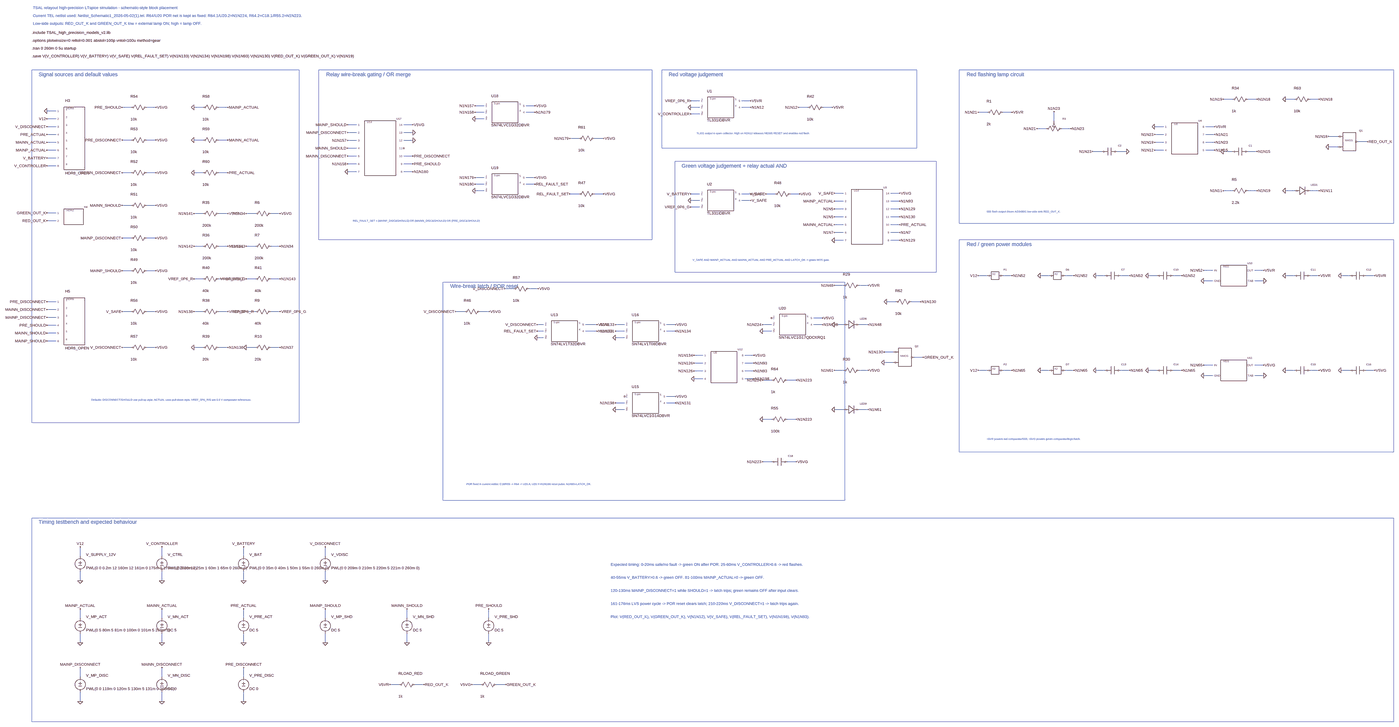
[diagram p0: schematic TSAL_relayout_high_precision.asc, whole sheet]
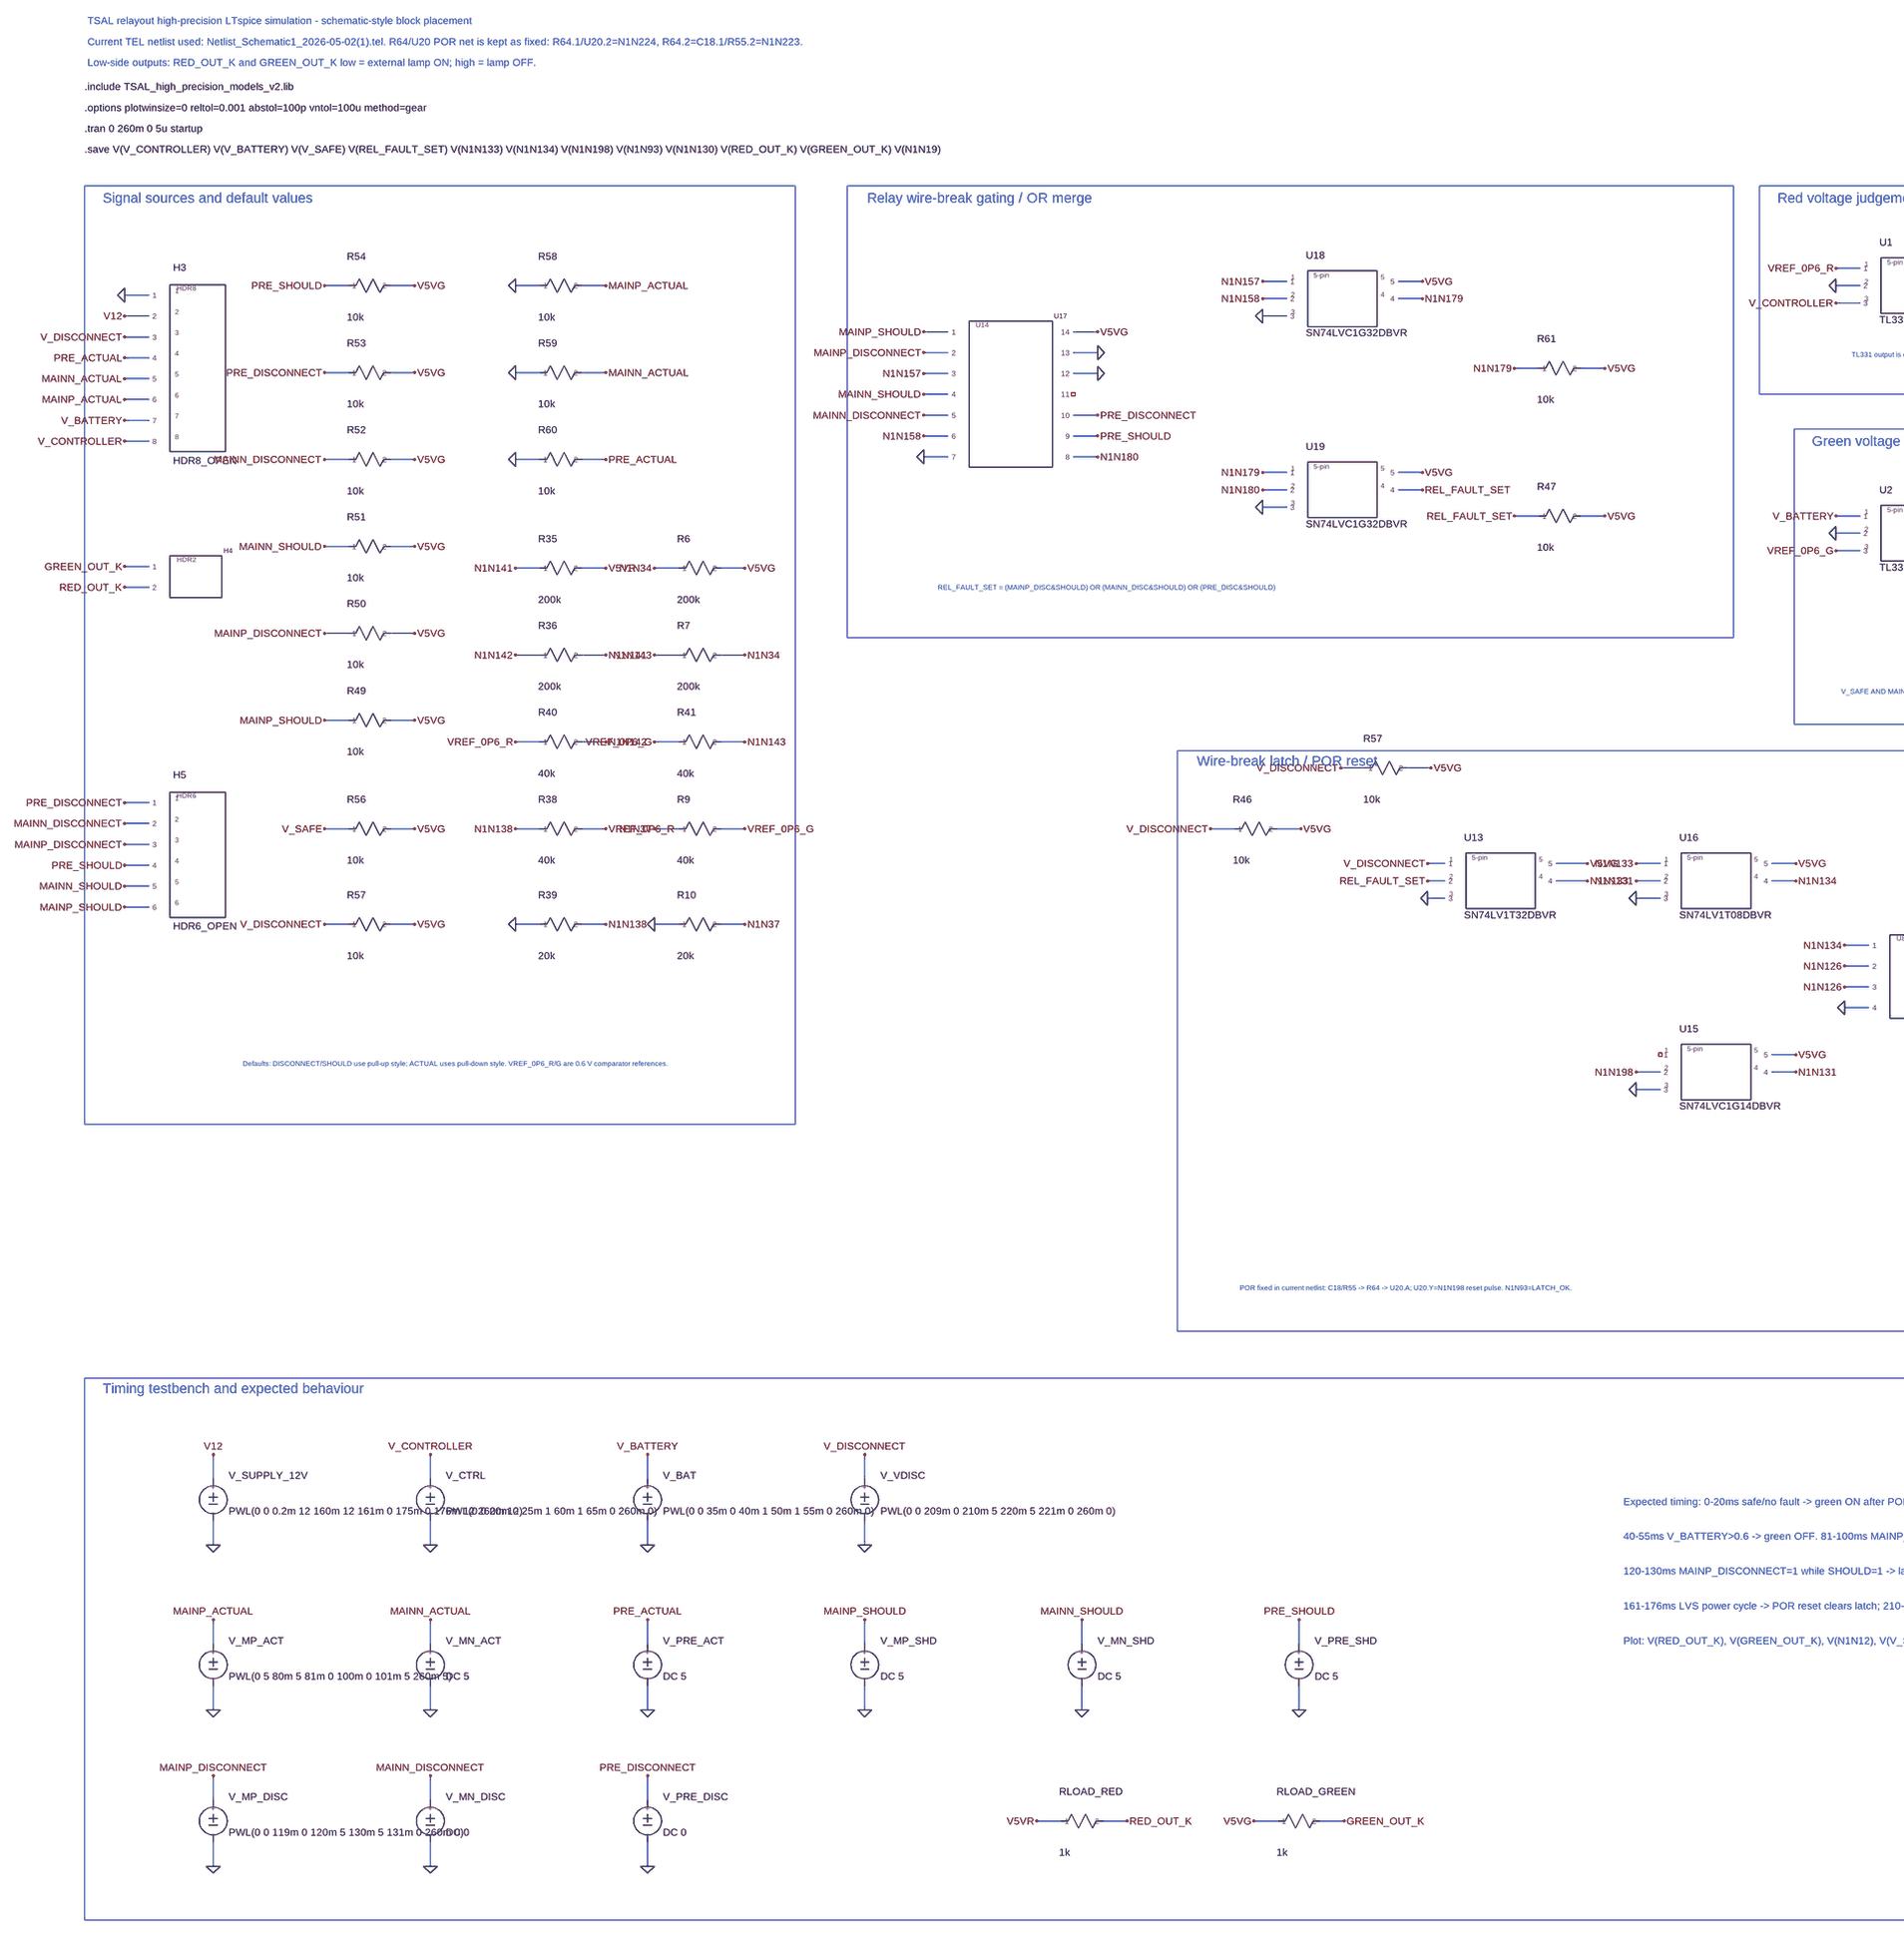
[diagram p1: schematic TSAL_relayout_high_precision.asc, part, row 1 of 1, column 1 of 2]
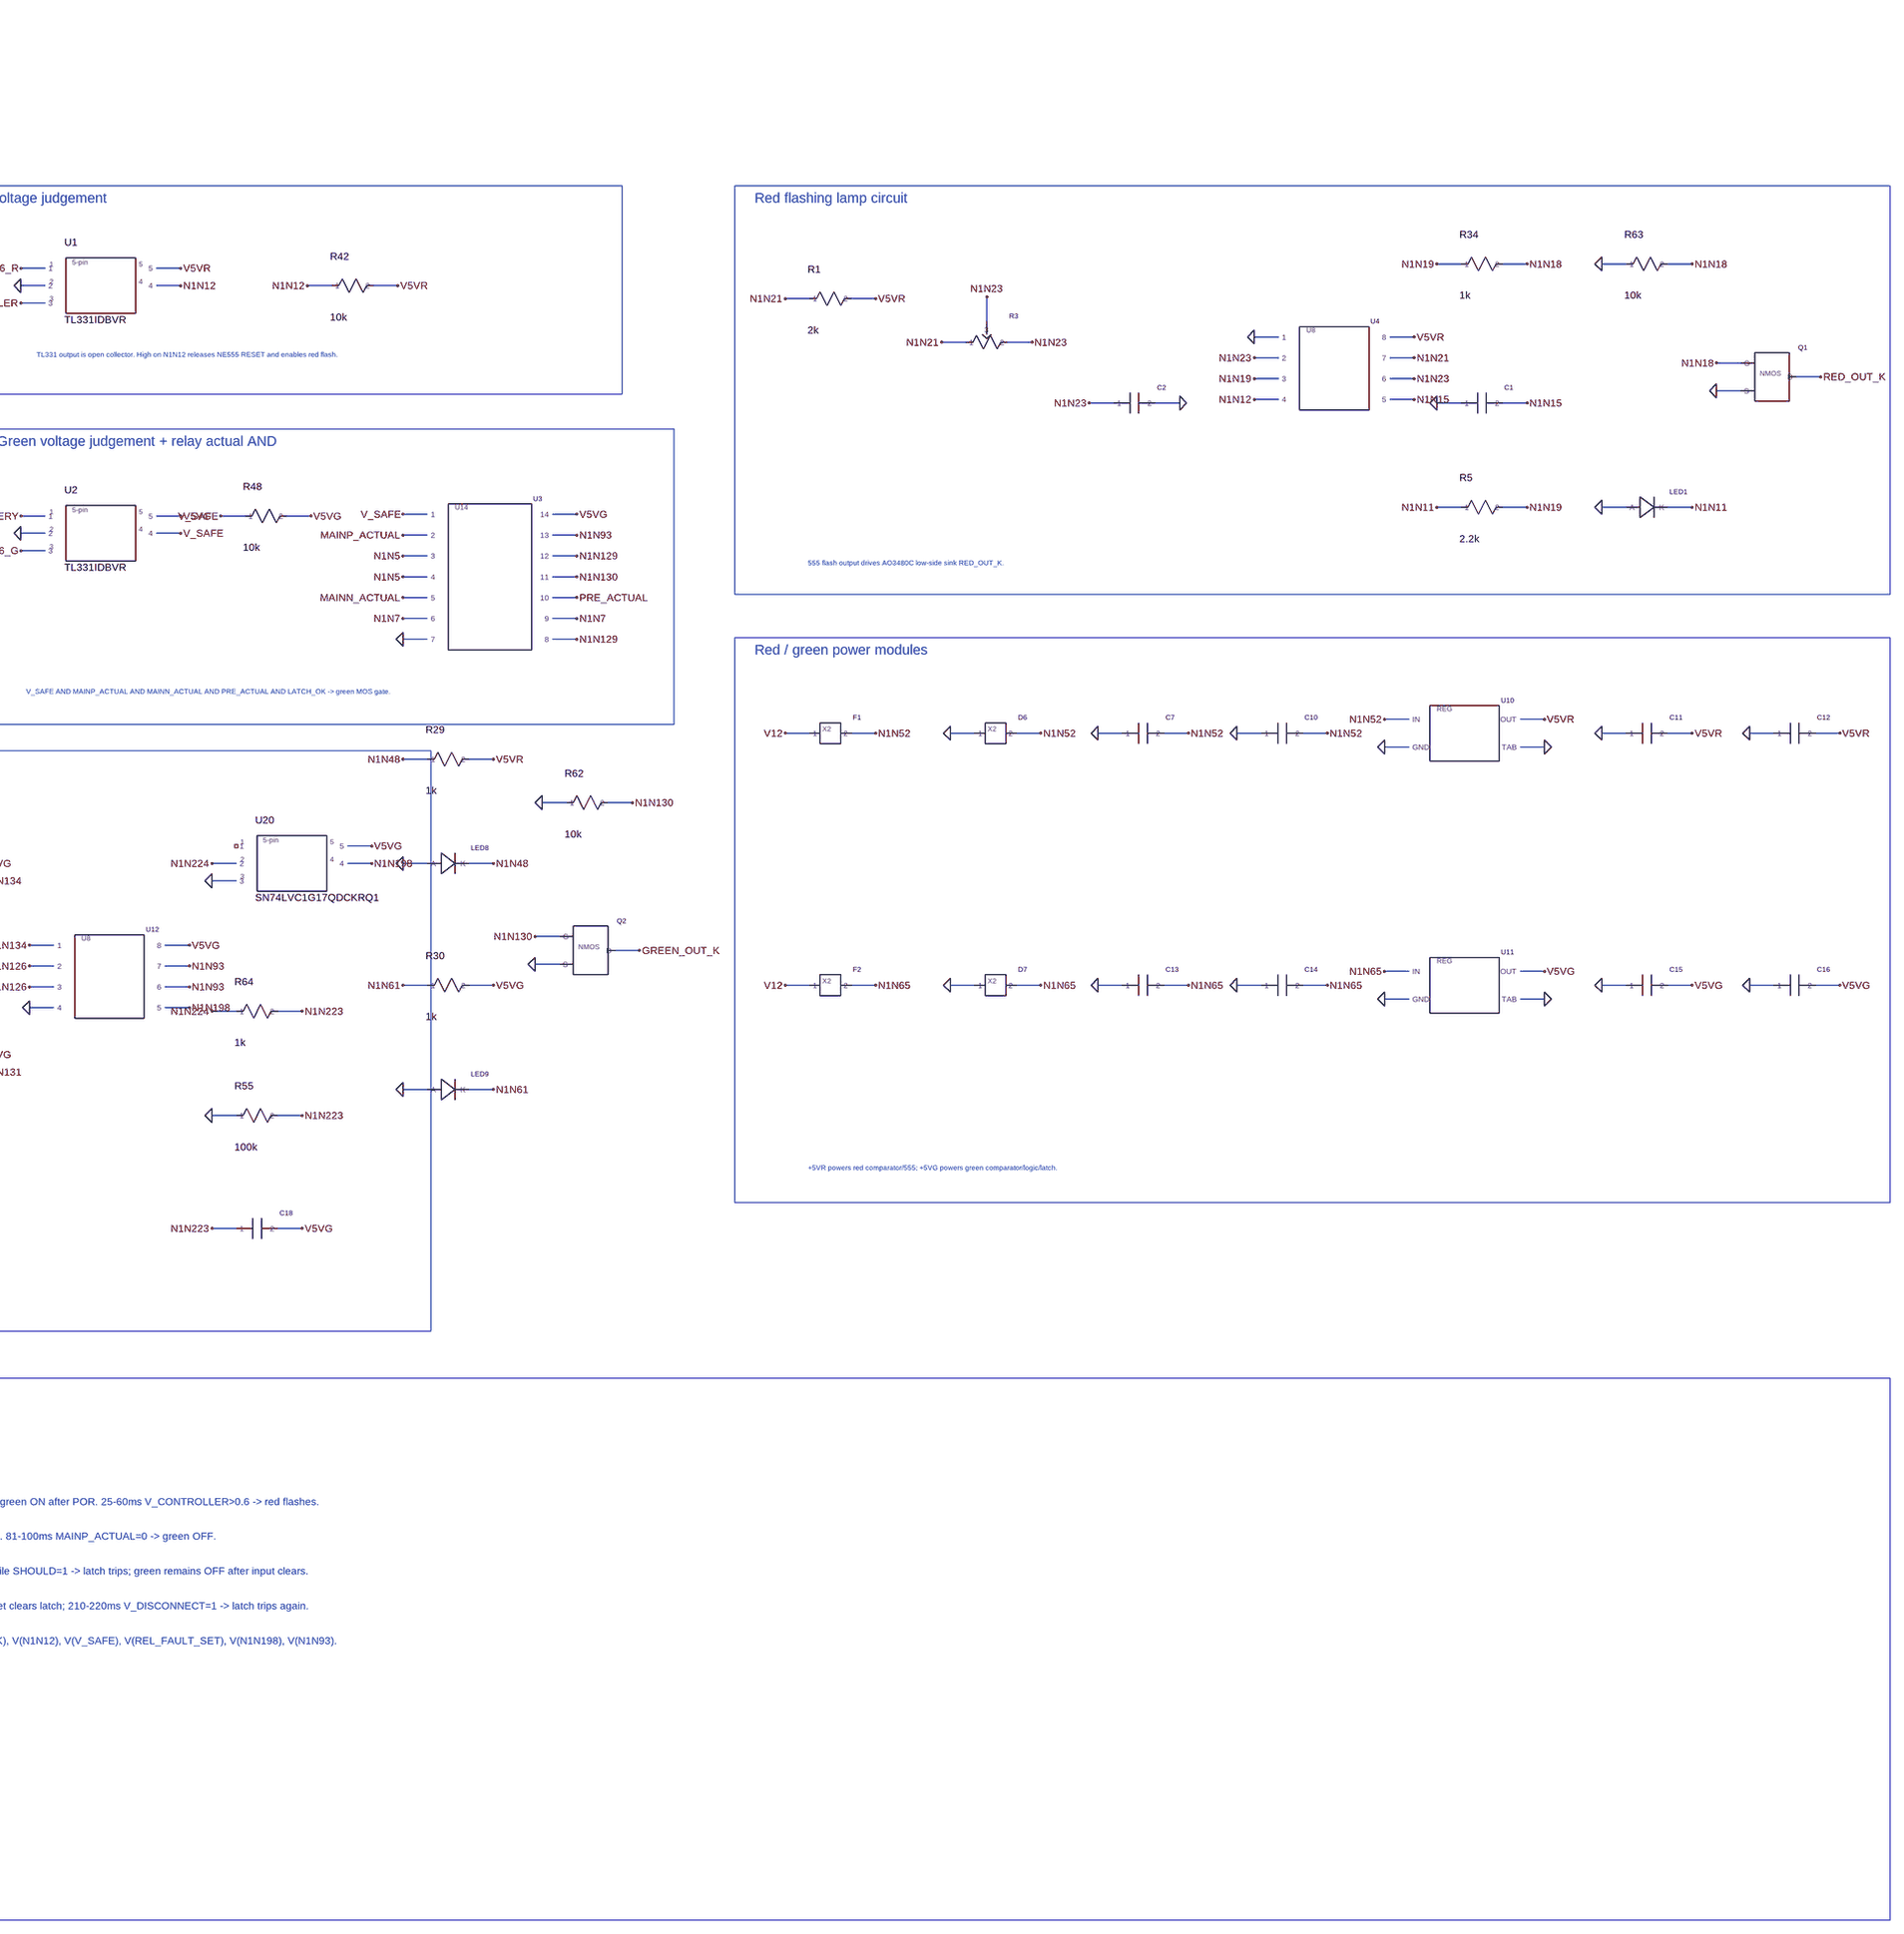
[diagram p2: schematic TSAL_relayout_high_precision.asc, part, row 1 of 1, column 2 of 2]
TSAL_relayout_high_precision.asc, the LTspice schematic file:
Version 4.1
SHEET 1 8600 5800
WIRE 7412 600 7356 600
WIRE 7564 600 7508 600
WIRE 7792 600 7736 600
WIRE 7944 600 7888 600
WIRE 4152 610 4096 610
WIRE 4464 610 4408 610
WIRE 2832 640 2776 640
WIRE 3144 640 3088 640
WIRE 672 650 616 650
WIRE 824 650 768 650
WIRE 1112 650 1056 650
WIRE 1264 650 1208 650
WIRE 4152 650 4096 650
WIRE 4464 650 4408 650
WIRE 4812 650 4756 650
WIRE 4964 650 4908 650
WIRE 212 672 156 672
WIRE 2832 680 2776 680
WIRE 3144 680 3088 680
WIRE 5912 680 5856 680
WIRE 6064 680 6008 680
WIRE 4152 690 4096 690
WIRE 212 720 156 720
WIRE 2832 720 2776 720
WIRE 6320 732 6320 676
WIRE 2052 756 1996 756
WIRE 2396 756 2340 756
WIRE 212 768 156 768
WIRE 6992 768 6936 768
WIRE 7304 768 7248 768
WIRE 6272 780 6216 780
WIRE 6424 780 6368 780
WIRE 2052 804 1996 804
WIRE 2396 804 2340 804
WIRE 212 816 156 816
WIRE 6992 816 6936 816
WIRE 7304 816 7248 816
WIRE 8056 828 8000 828
WIRE 3412 840 3356 840
WIRE 3564 840 3508 840
WIRE 672 850 616 850
WIRE 824 850 768 850
WIRE 1112 850 1056 850
WIRE 1264 850 1208 850
WIRE 2052 852 1996 852
WIRE 2396 852 2340 852
WIRE 8240 860 8184 860
WIRE 212 864 156 864
WIRE 6992 864 6936 864
WIRE 7304 864 7248 864
WIRE 8056 892 8000 892
WIRE 2052 900 1996 900
WIRE 212 912 156 912
WIRE 6992 912 6936 912
WIRE 7304 912 7248 912
WIRE 6612 920 6556 920
WIRE 6764 920 6708 920
WIRE 7412 920 7356 920
WIRE 7564 920 7508 920
WIRE 2052 948 1996 948
WIRE 2396 948 2340 948
WIRE 212 960 156 960
WIRE 2052 996 1996 996
WIRE 2396 996 2340 996
WIRE 212 1008 156 1008
WIRE 2052 1044 1996 1044
WIRE 2396 1044 2340 1044
WIRE 672 1050 616 1050
WIRE 824 1050 768 1050
WIRE 1112 1050 1056 1050
WIRE 1264 1050 1208 1050
WIRE 2832 1080 2776 1080
WIRE 3144 1080 3088 1080
WIRE 2832 1120 2776 1120
WIRE 3144 1120 3088 1120
WIRE 2832 1160 2776 1160
WIRE 7412 1160 7356 1160
WIRE 7564 1160 7508 1160
WIRE 7792 1160 7736 1160
WIRE 7944 1160 7888 1160
WIRE 5032 1176 4976 1176
WIRE 5376 1176 5320 1176
WIRE 3412 1180 3356 1180
WIRE 3564 1180 3508 1180
WIRE 4152 1180 4096 1180
WIRE 4464 1180 4408 1180
WIRE 4612 1180 4556 1180
WIRE 4764 1180 4708 1180
WIRE 4152 1220 4096 1220
WIRE 4464 1220 4408 1220
WIRE 5032 1224 4976 1224
WIRE 5376 1224 5320 1224
WIRE 672 1250 616 1250
WIRE 824 1250 768 1250
WIRE 4152 1260 4096 1260
WIRE 5032 1272 4976 1272
WIRE 5376 1272 5320 1272
WIRE 212 1296 156 1296
WIRE 1112 1300 1056 1300
WIRE 1264 1300 1208 1300
WIRE 1432 1300 1376 1300
WIRE 1584 1300 1528 1300
WIRE 5032 1320 4976 1320
WIRE 5376 1320 5320 1320
WIRE 212 1344 156 1344
WIRE 5032 1368 4976 1368
WIRE 5376 1368 5320 1368
WIRE 5032 1416 4976 1416
WIRE 5376 1416 5320 1416
WIRE 672 1450 616 1450
WIRE 824 1450 768 1450
WIRE 5032 1464 4976 1464
WIRE 5376 1464 5320 1464
WIRE 1112 1500 1056 1500
WIRE 1264 1500 1208 1500
WIRE 1432 1500 1376 1500
WIRE 1584 1500 1528 1500
WIRE 7292 1648 7236 1648
WIRE 7604 1648 7548 1648
WIRE 672 1650 616 1650
WIRE 824 1650 768 1650
WIRE 5912 1680 5856 1680
WIRE 6064 1680 6008 1680
WIRE 6292 1680 6236 1680
WIRE 6444 1680 6388 1680
WIRE 6632 1680 6576 1680
WIRE 6784 1680 6728 1680
WIRE 6952 1680 6896 1680
WIRE 7104 1680 7048 1680
WIRE 7792 1680 7736 1680
WIRE 7944 1680 7888 1680
WIRE 8132 1680 8076 1680
WIRE 8284 1680 8228 1680
WIRE 1112 1700 1056 1700
WIRE 1264 1700 1208 1700
WIRE 1432 1700 1376 1700
WIRE 1584 1700 1528 1700
WIRE 7292 1712 7236 1712
WIRE 7604 1712 7548 1712
WIRE 5032 1740 4976 1740
WIRE 5184 1740 5128 1740
WIRE 3012 1760 2956 1760
WIRE 3164 1760 3108 1760
WIRE 212 1840 156 1840
WIRE 5352 1840 5296 1840
WIRE 5504 1840 5448 1840
WIRE 212 1888 156 1888
WIRE 672 1900 616 1900
WIRE 824 1900 768 1900
WIRE 1112 1900 1056 1900
WIRE 1264 1900 1208 1900
WIRE 1432 1900 1376 1900
WIRE 1584 1900 1528 1900
WIRE 2712 1900 2656 1900
WIRE 2864 1900 2808 1900
WIRE 212 1936 156 1936
WIRE 4904 1940 4848 1940
WIRE 3196 1980 3156 1980
WIRE 3524 1980 3452 1980
WIRE 3692 1980 3636 1980
WIRE 4004 1980 3948 1980
WIRE 4592 1980 4536 1980
WIRE 4904 1980 4848 1980
WIRE 5032 1980 4976 1980
WIRE 5184 1980 5128 1980
WIRE 212 1984 156 1984
WIRE 3196 2020 3156 2020
WIRE 3524 2020 3452 2020
WIRE 3692 2020 3636 2020
WIRE 4004 2020 3948 2020
WIRE 4592 2020 4536 2020
WIRE 212 2032 156 2032
WIRE 3196 2060 3156 2060
WIRE 3692 2060 3636 2060
WIRE 212 2080 156 2080
WIRE 672 2120 616 2120
WIRE 824 2120 768 2120
WIRE 1112 2120 1056 2120
WIRE 1264 2120 1208 2120
WIRE 1432 2120 1376 2120
WIRE 1584 2120 1528 2120
WIRE 5336 2148 5280 2148
WIRE 4172 2168 4116 2168
WIRE 4484 2168 4428 2168
WIRE 5520 2180 5464 2180
WIRE 5336 2212 5280 2212
WIRE 4172 2216 4116 2216
WIRE 4484 2216 4428 2216
WIRE 7292 2228 7236 2228
WIRE 7604 2228 7548 2228
WIRE 5032 2260 4976 2260
WIRE 5184 2260 5128 2260
WIRE 5912 2260 5856 2260
WIRE 6064 2260 6008 2260
WIRE 6292 2260 6236 2260
WIRE 6444 2260 6388 2260
WIRE 6632 2260 6576 2260
WIRE 6784 2260 6728 2260
WIRE 6952 2260 6896 2260
WIRE 7104 2260 7048 2260
WIRE 7792 2260 7736 2260
WIRE 7944 2260 7888 2260
WIRE 8132 2260 8076 2260
WIRE 8284 2260 8228 2260
WIRE 4172 2264 4116 2264
WIRE 4484 2264 4428 2264
WIRE 7292 2292 7236 2292
WIRE 7604 2292 7548 2292
WIRE 4172 2312 4116 2312
WIRE 4484 2312 4428 2312
WIRE 4592 2320 4536 2320
WIRE 4744 2320 4688 2320
WIRE 4004 2420 3948 2420
WIRE 3692 2460 3636 2460
WIRE 4004 2460 3948 2460
WIRE 3692 2500 3636 2500
WIRE 5032 2500 4976 2500
WIRE 5184 2500 5128 2500
WIRE 4592 2560 4536 2560
WIRE 4744 2560 4688 2560
WIRE 4592 2820 4536 2820
WIRE 4744 2820 4688 2820
WIRE 360 3852 360 3796
WIRE 860 3852 860 3796
WIRE 1360 3852 1360 3796
WIRE 1860 3852 1860 3796
WIRE 360 4004 360 3948
WIRE 860 4004 860 3948
WIRE 1360 4004 1360 3948
WIRE 1860 4004 1860 3948
WIRE 360 4232 360 4176
WIRE 860 4232 860 4176
WIRE 1360 4232 1360 4176
WIRE 1860 4232 1860 4176
WIRE 2360 4232 2360 4176
WIRE 2860 4232 2860 4176
WIRE 360 4384 360 4328
WIRE 860 4384 860 4328
WIRE 1360 4384 1360 4328
WIRE 1860 4384 1860 4328
WIRE 2360 4384 2360 4328
WIRE 2860 4384 2860 4328
WIRE 360 4612 360 4556
WIRE 860 4612 860 4556
WIRE 1360 4612 1360 4556
WIRE 2312 4660 2256 4660
WIRE 2464 4660 2408 4660
WIRE 2812 4660 2756 4660
WIRE 2964 4660 2908 4660
WIRE 360 4764 360 4708
WIRE 860 4764 860 4708
WIRE 1360 4764 1360 4708
FLAG 156 672 0
FLAG 156 720 V12
FLAG 156 768 V_DISCONNECT
FLAG 156 816 PRE_ACTUAL
FLAG 156 864 MAINN_ACTUAL
FLAG 156 912 MAINP_ACTUAL
FLAG 156 960 V_BATTERY
FLAG 156 1008 V_CONTROLLER
FLAG 156 1296 GREEN_OUT_K
FLAG 156 1344 RED_OUT_K
FLAG 156 1840 PRE_DISCONNECT
FLAG 156 1888 MAINN_DISCONNECT
FLAG 156 1936 MAINP_DISCONNECT
FLAG 156 1984 PRE_SHOULD
FLAG 156 2032 MAINN_SHOULD
FLAG 156 2080 MAINP_SHOULD
FLAG 616 650 PRE_SHOULD
FLAG 824 650 V5VG
FLAG 616 850 PRE_DISCONNECT
FLAG 824 850 V5VG
FLAG 616 1050 MAINN_DISCONNECT
FLAG 824 1050 V5VG
FLAG 616 1250 MAINN_SHOULD
FLAG 824 1250 V5VG
FLAG 616 1450 MAINP_DISCONNECT
FLAG 824 1450 V5VG
FLAG 616 1650 MAINP_SHOULD
FLAG 824 1650 V5VG
FLAG 616 1900 V_SAFE
FLAG 824 1900 V5VG
FLAG 616 2120 V_DISCONNECT
FLAG 824 2120 V5VG
FLAG 1056 650 0
FLAG 1264 650 MAINP_ACTUAL
FLAG 1056 850 0
FLAG 1264 850 MAINN_ACTUAL
FLAG 1056 1050 0
FLAG 1264 1050 PRE_ACTUAL
FLAG 1056 1300 N1N141
FLAG 1264 1300 V5VR
FLAG 1056 1500 N1N142
FLAG 1264 1500 N1N141
FLAG 1056 1700 VREF_0P6_R
FLAG 1264 1700 N1N142
FLAG 1056 1900 N1N138
FLAG 1264 1900 VREF_0P6_R
FLAG 1056 2120 0
FLAG 1264 2120 N1N138
FLAG 1376 1300 N1N34
FLAG 1584 1300 V5VG
FLAG 1376 1500 N1N143
FLAG 1584 1500 N1N34
FLAG 1376 1700 VREF_0P6_G
FLAG 1584 1700 N1N143
FLAG 1376 1900 N1N37
FLAG 1584 1900 VREF_0P6_G
FLAG 1376 2120 0
FLAG 1584 2120 N1N37
FLAG 1996 756 MAINP_SHOULD
FLAG 1996 804 MAINP_DISCONNECT
FLAG 1996 852 N1N157
FLAG 1996 900 MAINN_SHOULD
FLAG 1996 948 MAINN_DISCONNECT
FLAG 1996 996 N1N158
FLAG 1996 1044 0
FLAG 2396 1044 N1N180
FLAG 2396 996 PRE_SHOULD
FLAG 2396 948 PRE_DISCONNECT
FLAG 2396 852 0
FLAG 2396 804 0
FLAG 2396 756 V5VG
FLAG 2776 640 N1N157
FLAG 2776 680 N1N158
FLAG 2776 720 0
FLAG 3144 680 N1N179
FLAG 3144 640 V5VG
FLAG 2776 1080 N1N179
FLAG 2776 1120 N1N180
FLAG 2776 1160 0
FLAG 3144 1120 REL_FAULT_SET
FLAG 3144 1080 V5VG
FLAG 3356 840 N1N179
FLAG 3564 840 V5VG
FLAG 3356 1180 REL_FAULT_SET
FLAG 3564 1180 V5VG
FLAG 4096 610 VREF_0P6_R
FLAG 4096 650 0
FLAG 4096 690 V_CONTROLLER
FLAG 4464 650 N1N12
FLAG 4464 610 V5VR
FLAG 4756 650 N1N12
FLAG 4964 650 V5VR
FLAG 4096 1180 V_BATTERY
FLAG 4096 1220 0
FLAG 4096 1260 VREF_0P6_G
FLAG 4464 1220 V_SAFE
FLAG 4464 1180 V5VG
FLAG 4556 1180 V_SAFE
FLAG 4764 1180 V5VG
FLAG 4976 1176 V_SAFE
FLAG 4976 1224 MAINP_ACTUAL
FLAG 4976 1272 N1N5
FLAG 4976 1320 N1N5
FLAG 4976 1368 MAINN_ACTUAL
FLAG 4976 1416 N1N7
FLAG 4976 1464 0
FLAG 5376 1464 N1N129
FLAG 5376 1416 N1N7
FLAG 5376 1368 PRE_ACTUAL
FLAG 5376 1320 N1N130
FLAG 5376 1272 N1N129
FLAG 5376 1224 N1N93
FLAG 5376 1176 V5VG
FLAG 2656 1900 V_DISCONNECT
FLAG 2864 1900 V5VG
FLAG 2956 1760 V_DISCONNECT
FLAG 3164 1760 V5VG
FLAG 3156 1980 V_DISCONNECT
FLAG 3156 2020 REL_FAULT_SET
FLAG 3156 2060 0
FLAG 3524 2020 N1N133
FLAG 3524 1980 V5VG
FLAG 3636 1980 N1N133
FLAG 3636 2020 N1N131
FLAG 3636 2060 0
FLAG 4004 2020 N1N134
FLAG 4004 1980 V5VG
FLAG 3636 2460 N1N198
FLAG 3636 2500 0
FLAG 4004 2460 N1N131
FLAG 4004 2420 V5VG
FLAG 4116 2168 N1N134
FLAG 4116 2216 N1N126
FLAG 4116 2264 N1N126
FLAG 4116 2312 0
FLAG 4484 2312 N1N198
FLAG 4484 2264 N1N93
FLAG 4484 2216 N1N93
FLAG 4484 2168 V5VG
FLAG 4536 1980 N1N224
FLAG 4536 2020 0
FLAG 4904 1980 N1N198
FLAG 4904 1940 V5VG
FLAG 4536 2320 N1N224
FLAG 4744 2320 N1N223
FLAG 4536 2560 0
FLAG 4744 2560 N1N223
FLAG 4536 2820 N1N223
FLAG 4744 2820 V5VG
FLAG 5856 680 N1N21
FLAG 6064 680 V5VR
FLAG 6216 780 N1N21
FLAG 6424 780 N1N23
FLAG 6320 676 N1N23
FLAG 6556 920 N1N23
FLAG 6764 920 0
FLAG 6936 768 0
FLAG 6936 816 N1N23
FLAG 6936 864 N1N19
FLAG 6936 912 N1N12
FLAG 7304 912 N1N15
FLAG 7304 864 N1N23
FLAG 7304 816 N1N21
FLAG 7304 768 V5VR
FLAG 7356 920 0
FLAG 7564 920 N1N15
FLAG 7356 1160 N1N11
FLAG 7564 1160 N1N19
FLAG 7736 1160 0
FLAG 7944 1160 N1N11
FLAG 7356 600 N1N19
FLAG 7564 600 N1N18
FLAG 7736 600 0
FLAG 7944 600 N1N18
FLAG 8000 828 N1N18
FLAG 8000 892 0
FLAG 8240 860 RED_OUT_K
FLAG 5856 1680 V12
FLAG 6064 1680 N1N52
FLAG 6236 1680 0
FLAG 6444 1680 N1N52
FLAG 6576 1680 0
FLAG 6784 1680 N1N52
FLAG 6896 1680 0
FLAG 7104 1680 N1N52
FLAG 7236 1648 N1N52
FLAG 7236 1712 0
FLAG 7604 1648 V5VR
FLAG 7604 1712 0
FLAG 7736 1680 0
FLAG 7944 1680 V5VR
FLAG 8076 1680 0
FLAG 8284 1680 V5VR
FLAG 5856 2260 V12
FLAG 6064 2260 N1N65
FLAG 6236 2260 0
FLAG 6444 2260 N1N65
FLAG 6576 2260 0
FLAG 6784 2260 N1N65
FLAG 6896 2260 0
FLAG 7104 2260 N1N65
FLAG 7236 2228 N1N65
FLAG 7236 2292 0
FLAG 7604 2228 V5VG
FLAG 7604 2292 0
FLAG 7736 2260 0
FLAG 7944 2260 V5VG
FLAG 8076 2260 0
FLAG 8284 2260 V5VG
FLAG 5296 1840 0
FLAG 5504 1840 N1N130
FLAG 5280 2148 N1N130
FLAG 5280 2212 0
FLAG 5520 2180 GREEN_OUT_K
FLAG 4976 1740 N1N48
FLAG 5184 1740 V5VR
FLAG 4976 1980 0
FLAG 5184 1980 N1N48
FLAG 4976 2260 N1N61
FLAG 5184 2260 V5VG
FLAG 4976 2500 0
FLAG 5184 2500 N1N61
FLAG 360 3796 V12
FLAG 360 4004 0
FLAG 860 3796 V_CONTROLLER
FLAG 860 4004 0
FLAG 1360 3796 V_BATTERY
FLAG 1360 4004 0
FLAG 1860 3796 V_DISCONNECT
FLAG 1860 4004 0
FLAG 360 4176 MAINP_ACTUAL
FLAG 360 4384 0
FLAG 860 4176 MAINN_ACTUAL
FLAG 860 4384 0
FLAG 1360 4176 PRE_ACTUAL
FLAG 1360 4384 0
FLAG 1860 4176 MAINP_SHOULD
FLAG 1860 4384 0
FLAG 2360 4176 MAINN_SHOULD
FLAG 2360 4384 0
FLAG 2860 4176 PRE_SHOULD
FLAG 2860 4384 0
FLAG 360 4556 MAINP_DISCONNECT
FLAG 360 4764 0
FLAG 860 4556 MAINN_DISCONNECT
FLAG 860 4764 0
FLAG 1360 4556 PRE_DISCONNECT
FLAG 1360 4764 0
FLAG 2256 4660 V5VR
FLAG 2464 4660 RED_OUT_K
FLAG 2756 4660 V5VG
FLAG 2964 4660 GREEN_OUT_K
SYMBOL TSAL_HDR8 260 840 R0
SYMATTR InstName H3
SYMATTR Value HDR8_OPEN
SYMBOL TSAL_HDR2 260 1320 R0
SYMATTR InstName H4
SYMATTR Value HDR2_OPEN
SYMBOL TSAL_HDR6 260 1960 R0
SYMATTR InstName H5
SYMATTR Value HDR6_OPEN
SYMBOL TSAL_R 720 650 R0
SYMATTR InstName R54
SYMATTR Value 10k
SYMBOL TSAL_R 720 850 R0
SYMATTR InstName R53
SYMATTR Value 10k
SYMBOL TSAL_R 720 1050 R0
SYMATTR InstName R52
SYMATTR Value 10k
SYMBOL TSAL_R 720 1250 R0
SYMATTR InstName R51
SYMATTR Value 10k
SYMBOL TSAL_R 720 1450 R0
SYMATTR InstName R50
SYMATTR Value 10k
SYMBOL TSAL_R 720 1650 R0
SYMATTR InstName R49
SYMATTR Value 10k
SYMBOL TSAL_R 720 1900 R0
SYMATTR InstName R56
SYMATTR Value 10k
SYMBOL TSAL_R 720 2120 R0
SYMATTR InstName R57
SYMATTR Value 10k
SYMBOL TSAL_R 1160 650 R0
SYMATTR InstName R58
SYMATTR Value 10k
SYMBOL TSAL_R 1160 850 R0
SYMATTR InstName R59
SYMATTR Value 10k
SYMBOL TSAL_R 1160 1050 R0
SYMATTR InstName R60
SYMATTR Value 10k
SYMBOL TSAL_R 1160 1300 R0
SYMATTR InstName R35
SYMATTR Value 200k
SYMBOL TSAL_R 1160 1500 R0
SYMATTR InstName R36
SYMATTR Value 200k
SYMBOL TSAL_R 1160 1700 R0
SYMATTR InstName R40
SYMATTR Value 40k
SYMBOL TSAL_R 1160 1900 R0
SYMATTR InstName R38
SYMATTR Value 40k
SYMBOL TSAL_R 1160 2120 R0
SYMATTR InstName R39
SYMATTR Value 20k
SYMBOL TSAL_R 1480 1300 R0
SYMATTR InstName R6
SYMATTR Value 200k
SYMBOL TSAL_R 1480 1500 R0
SYMATTR InstName R7
SYMATTR Value 200k
SYMBOL TSAL_R 1480 1700 R0
SYMATTR InstName R41
SYMATTR Value 40k
SYMBOL TSAL_R 1480 1900 R0
SYMATTR InstName R9
SYMATTR Value 40k
SYMBOL TSAL_R 1480 2120 R0
SYMATTR InstName R10
SYMATTR Value 20k
SYMBOL TSAL_U14 2100 900 R0
SYMATTR InstName U17
SYMATTR Value CD74HC08
SYMBOL TSAL_U5 2880 680 R0
SYMATTR InstName U18
SYMATTR Value SN74LVC1G32DBVR
SYMBOL TSAL_U5 2880 1120 R0
SYMATTR InstName U19
SYMATTR Value SN74LVC1G32DBVR
SYMBOL TSAL_R 3460 840 R0
SYMATTR InstName R61
SYMATTR Value 10k
SYMBOL TSAL_R 3460 1180 R0
SYMATTR InstName R47
SYMATTR Value 10k
SYMBOL TSAL_U5 4200 650 R0
SYMATTR InstName U1
SYMATTR Value TL331IDBVR
SYMBOL TSAL_R 4860 650 R0
SYMATTR InstName R42
SYMATTR Value 10k
SYMBOL TSAL_U5 4200 1220 R0
SYMATTR InstName U2
SYMATTR Value TL331IDBVR
SYMBOL TSAL_R 4660 1180 R0
SYMATTR InstName R48
SYMATTR Value 10k
SYMBOL TSAL_U14 5080 1320 R0
SYMATTR InstName U3
SYMATTR Value CD74HC08
SYMBOL TSAL_R 2760 1900 R0
SYMATTR InstName R46
SYMATTR Value 10k
SYMBOL TSAL_R 3060 1760 R0
SYMATTR InstName R57
SYMATTR Value 10k
SYMBOL TSAL_U5 3244 2020 R0
SYMATTR InstName U13
SYMATTR Value SN74LV1T32DBVR
SYMBOL TSAL_U5 3740 2020 R0
SYMATTR InstName U16
SYMATTR Value SN74LV1T08DBVR
SYMBOL TSAL_U5 3740 2460 R0
SYMATTR InstName U15
SYMATTR Value SN74LVC1G14DBVR
SYMBOL TSAL_U8 4220 2240 R0
SYMATTR InstName U12
SYMATTR Value SN74LVC2G02DCTR
SYMBOL TSAL_U5 4640 1980 R0
SYMATTR InstName U20
SYMATTR Value SN74LVC1G17QDCKRQ1
SYMBOL TSAL_R 4640 2320 R0
SYMATTR InstName R64
SYMATTR Value 1k
SYMBOL TSAL_R 4640 2560 R0
SYMATTR InstName R55
SYMATTR Value 100k
SYMBOL TSAL_C 4640 2820 R0
SYMATTR InstName C18
SYMATTR Value 1µ
SYMBOL TSAL_R 5960 680 R0
SYMATTR InstName R1
SYMATTR Value 2k
SYMBOL TSAL_POT3 6320 780 R0
SYMATTR InstName R3
SYMATTR Value POT_TIED
SYMATTR SpiceLine PARAMS: R=25k
SYMBOL TSAL_C 6660 920 R0
SYMATTR InstName C2
SYMATTR Value 10µ
SYMBOL TSAL_U8 7040 840 R0
SYMATTR InstName U4
SYMATTR Value NE555DR_HP
SYMBOL TSAL_C 7460 920 R0
SYMATTR InstName C1
SYMATTR Value 10n
SYMBOL TSAL_R 7460 1160 R0
SYMATTR InstName R5
SYMATTR Value 2.2k
SYMBOL TSAL_DIODE 7840 1160 R0
SYMATTR InstName LED1
SYMATTR Value DLED_RED
SYMBOL TSAL_R 7460 600 R0
SYMATTR InstName R34
SYMATTR Value 1k
SYMBOL TSAL_R 7840 600 R0
SYMATTR InstName R63
SYMATTR Value 10k
SYMBOL TSAL_NMOS3 8120 860 R0
SYMATTR InstName Q1
SYMATTR Value AO3480C_MACRO
SYMBOL TSAL_X2 5960 1680 R0
SYMATTR InstName F1
SYMATTR Value SMD2920P075TF_MACRO
SYMBOL TSAL_X2 6340 1680 R0
SYMATTR InstName D6
SYMATTR Value SMBJ18CA_MACRO
SYMBOL TSAL_C 6680 1680 R0
SYMATTR InstName C7
SYMATTR Value 220n
SYMBOL TSAL_C 7000 1680 R0
SYMATTR InstName C10
SYMATTR Value 10µ
SYMBOL TSAL_U4REG 7340 1680 R0
SYMATTR InstName U10
SYMATTR Value LM340MP_5V
SYMBOL TSAL_C 7840 1680 R0
SYMATTR InstName C11
SYMATTR Value 10µ
SYMBOL TSAL_C 8180 1680 R0
SYMATTR InstName C12
SYMATTR Value 100n
SYMBOL TSAL_X2 5960 2260 R0
SYMATTR InstName F2
SYMATTR Value SMD2920P075TF_MACRO
SYMBOL TSAL_X2 6340 2260 R0
SYMATTR InstName D7
SYMATTR Value SMBJ18CA_MACRO
SYMBOL TSAL_C 6680 2260 R0
SYMATTR InstName C13
SYMATTR Value 220n
SYMBOL TSAL_C 7000 2260 R0
SYMATTR InstName C14
SYMATTR Value 10µ
SYMBOL TSAL_U4REG 7340 2260 R0
SYMATTR InstName U11
SYMATTR Value LM340MP_5V
SYMBOL TSAL_C 7840 2260 R0
SYMATTR InstName C15
SYMATTR Value 10µ
SYMBOL TSAL_C 8180 2260 R0
SYMATTR InstName C16
SYMATTR Value 100n
SYMBOL TSAL_R 5400 1840 R0
SYMATTR InstName R62
SYMATTR Value 10k
SYMBOL TSAL_NMOS3 5400 2180 R0
SYMATTR InstName Q2
SYMATTR Value AO3480C_MACRO
SYMBOL TSAL_R 5080 1740 R0
SYMATTR InstName R29
SYMATTR Value 1k
SYMBOL TSAL_DIODE 5080 1980 R0
SYMATTR InstName LED8
SYMATTR Value DLED_RED
SYMBOL TSAL_R 5080 2260 R0
SYMATTR InstName R30
SYMATTR Value 1k
SYMBOL TSAL_DIODE 5080 2500 R0
SYMATTR InstName LED9
SYMATTR Value DLED_RED
SYMBOL TSAL_VSRC 360 3900 R0
SYMATTR InstName V_SUPPLY_12V
SYMATTR Value PWL(0 0 0.2m 12 160m 12 161m 0 175m 0 176m 12 260m 12)
SYMBOL TSAL_VSRC 860 3900 R0
SYMATTR InstName V_CTRL
SYMATTR Value PWL(0 0 20m 0 25m 1 60m 1 65m 0 260m 0)
SYMBOL TSAL_VSRC 1360 3900 R0
SYMATTR InstName V_BAT
SYMATTR Value PWL(0 0 35m 0 40m 1 50m 1 55m 0 260m 0)
SYMBOL TSAL_VSRC 1860 3900 R0
SYMATTR InstName V_VDISC
SYMATTR Value PWL(0 0 209m 0 210m 5 220m 5 221m 0 260m 0)
SYMBOL TSAL_VSRC 360 4280 R0
SYMATTR InstName V_MP_ACT
SYMATTR Value PWL(0 5 80m 5 81m 0 100m 0 101m 5 260m 5)
SYMBOL TSAL_VSRC 860 4280 R0
SYMATTR InstName V_MN_ACT
SYMATTR Value DC 5
SYMBOL TSAL_VSRC 1360 4280 R0
SYMATTR InstName V_PRE_ACT
SYMATTR Value DC 5
SYMBOL TSAL_VSRC 1860 4280 R0
SYMATTR InstName V_MP_SHD
SYMATTR Value DC 5
SYMBOL TSAL_VSRC 2360 4280 R0
SYMATTR InstName V_MN_SHD
SYMATTR Value DC 5
SYMBOL TSAL_VSRC 2860 4280 R0
SYMATTR InstName V_PRE_SHD
SYMATTR Value DC 5
SYMBOL TSAL_VSRC 360 4660 R0
SYMATTR InstName V_MP_DISC
SYMATTR Value PWL(0 0 119m 0 120m 5 130m 5 131m 0 260m 0)
SYMBOL TSAL_VSRC 860 4660 R0
SYMATTR InstName V_MN_DISC
SYMATTR Value DC 0
SYMBOL TSAL_VSRC 1360 4660 R0
SYMATTR InstName V_PRE_DISC
SYMATTR Value DC 0
SYMBOL TSAL_R 2360 4660 R0
SYMATTR InstName RLOAD_RED
SYMATTR Value 1k
SYMBOL TSAL_R 2860 4660 R0
SYMATTR InstName RLOAD_GREEN
SYMATTR Value 1k
TEXT 64 40 Left 2 ; TSAL relayout high-precision LTspice simulation - schematic-style block placement
TEXT 64 88 Left 2 ; Current TEL netlist used: Netlist_Schematic1_2026-05-02(1).tel. R64/U20 POR net is kept as fixed: R64.1/U20.2=N1N224, R64.2=C18.1/R55.2=N1N223.
TEXT 64 136 Left 2 ; Low-side outputs: RED_OUT_K and GREEN_OUT_K low = external lamp ON; high = lamp OFF.
TEXT 64 192 Left 2 !.include TSAL_high_precision_models_v2.lib
TEXT 64 240 Left 2 !.options plotwinsize=0 reltol=0.001 abstol=100p vntol=100u method=gear
TEXT 64 288 Left 2 !.tran 0 260m 0 5u startup
TEXT 64 336 Left 2 !.save V(V_CONTROLLER) V(V_BATTERY) V(V_SAFE) V(REL_FAULT_SET) V(N1N133) V(N1N134) V(N1N198) V(N1N93) V(N1N130) V(RED_OUT_K) V(GREEN_OUT_K) V(N1N19)
TEXT 96 448 Left 3 ; Signal sources and default values
TEXT 1856 448 Left 3 ; Relay wire-break gating / OR merge
TEXT 3952 448 Left 3 ; Red voltage judgement
TEXT 4032 1008 Left 3 ; Green voltage judgement + relay actual AND
TEXT 2616 1744 Left 3 ; Wire-break latch / POR reset
TEXT 5776 448 Left 3 ; Red flashing lamp circuit
TEXT 5776 1488 Left 3 ; Red / green power modules
TEXT 96 3624 Left 3 ; Timing testbench and expected behaviour
TEXT 424 2440 Left 1 ; Defaults: DISCONNECT/SHOULD use pull-up style; ACTUAL uses pull-down style. VREF_0P6_R/G are 0.6 V comparator references.
TEXT 2024 1344 Left 1 ; REL_FAULT_SET = (MAINP_DISC&SHOULD) OR (MAINN_DISC&SHOULD) OR (PRE_DISC&SHOULD)
TEXT 4128 808 Left 1 ; TL331 output is open collector. High on N1N12 releases NE555 RESET and enables red flash.
TEXT 4104 1584 Left 1 ; V_SAFE AND MAINP_ACTUAL AND MAINN_ACTUAL AND PRE_ACTUAL AND LATCH_OK -> green MOS gate.
TEXT 2720 2960 Left 1 ; POR fixed in current netlist: C18/R55 -> R64 -> U20.A; U20.Y=N1N198 reset pulse. N1N93=LATCH_OK.
TEXT 5904 1288 Left 1 ; 555 flash output drives AO3480C low-side sink RED_OUT_K.
TEXT 5904 2680 Left 1 ; +5VR powers red comparator/555; +5VG powers green comparator/logic/latch.
TEXT 3600 3904 Left 2 ; Expected timing: 0-20ms safe/no fault -> green ON after POR. 25-60ms V_CONTROLLER>0.6 -> red flashes.
TEXT 3600 3984 Left 2 ; 40-55ms V_BATTERY>0.6 -> green OFF. 81-100ms MAINP_ACTUAL=0 -> green OFF.
TEXT 3600 4064 Left 2 ; 120-130ms MAINP_DISCONNECT=1 while SHOULD=1 -> latch trips; green remains OFF after input clears.
TEXT 3600 4144 Left 2 ; 161-176ms LVS power cycle -> POR reset clears latch; 210-220ms V_DISCONNECT=1 -> latch trips again.
TEXT 3600 4224 Left 2 ; Plot: V(RED_OUT_K), V(GREEN_OUT_K), V(N1N12), V(V_SAFE), V(REL_FAULT_SET), V(N1N198), V(N1N93).
LINE Normal 64 420 1700 420
LINE Normal 1700 420 1700 2580
LINE Normal 1700 2580 64 2580
LINE Normal 64 2580 64 420
LINE Normal 1820 420 3860 420
LINE Normal 3860 420 3860 1460
LINE Normal 3860 1460 1820 1460
LINE Normal 1820 1460 1820 420
LINE Normal 3920 420 5480 420
LINE Normal 5480 420 5480 900
LINE Normal 5480 900 3920 900
LINE Normal 3920 900 3920 420
LINE Normal 4000 980 5600 980
LINE Normal 5600 980 5600 1660
LINE Normal 5600 1660 4000 1660
LINE Normal 4000 1660 4000 980
LINE Normal 2580 1720 5040 1720
LINE Normal 5040 1720 5040 3060
LINE Normal 5040 3060 2580 3060
LINE Normal 2580 3060 2580 1720
LINE Normal 5740 420 8400 420
LINE Normal 8400 420 8400 1360
LINE Normal 8400 1360 5740 1360
LINE Normal 5740 1360 5740 420
LINE Normal 5740 1460 8400 1460
LINE Normal 8400 1460 8400 2760
LINE Normal 8400 2760 5740 2760
LINE Normal 5740 2760 5740 1460
LINE Normal 64 3600 8400 3600
LINE Normal 8400 3600 8400 5400
LINE Normal 8400 5400 64 5400
LINE Normal 64 5400 64 3600

The netlist it stands for:
* TSAL_relayout_high_precision.asc
X§H3 0 V12 V_DISCONNECT PRE_ACTUAL MAINN_ACTUAL MAINP_ACTUAL V_BATTERY V_CONTROLLER HDR8_OPEN  ; pins 1 2 3 4 5 6 7 8
X§H4 GREEN_OUT_K RED_OUT_K HDR2_OPEN  ; pins 1 2
X§H5 PRE_DISCONNECT MAINN_DISCONNECT MAINP_DISCONNECT PRE_SHOULD MAINN_SHOULD MAINP_SHOULD HDR6_OPEN  ; pins 1 2 3 4 5 6
R54 PRE_SHOULD V5VG 10k
R53 PRE_DISCONNECT V5VG 10k
R52 MAINN_DISCONNECT V5VG 10k
R51 MAINN_SHOULD V5VG 10k
R50 MAINP_DISCONNECT V5VG 10k
R49 MAINP_SHOULD V5VG 10k
R56 V_SAFE V5VG 10k
R57 V_DISCONNECT V5VG 10k
R58 0 MAINP_ACTUAL 10k
R59 0 MAINN_ACTUAL 10k
R60 0 PRE_ACTUAL 10k
R35 N1N141 V5VR 200k
R36 N1N142 N1N141 200k
R40 VREF_0P6_R N1N142 40k
R38 N1N138 VREF_0P6_R 40k
R39 0 N1N138 20k
R6 N1N34 V5VG 200k
R7 N1N143 N1N34 200k
R41 VREF_0P6_G N1N143 40k
R9 N1N37 VREF_0P6_G 40k
R10 0 N1N37 20k
X§U17 MAINP_SHOULD MAINP_DISCONNECT N1N157 MAINN_SHOULD MAINN_DISCONNECT N1N158 0 N1N180 PRE_SHOULD PRE_DISCONNECT NC_01 0 0 V5VG CD74HC08  ; pins 1 2 3 4 5 6 7 8 9 10 11 12 13 14
X§U18 N1N157 N1N158 0 N1N179 V5VG SN74LVC1G32DBVR  ; pins 1 2 3 4 5
X§U19 N1N179 N1N180 0 REL_FAULT_SET V5VG SN74LVC1G32DBVR  ; pins 1 2 3 4 5
R61 N1N179 V5VG 10k
R47 REL_FAULT_SET V5VG 10k
X§U1 VREF_0P6_R 0 V_CONTROLLER N1N12 V5VR TL331IDBVR  ; pins 1 2 3 4 5
R42 N1N12 V5VR 10k
X§U2 V_BATTERY 0 VREF_0P6_G V_SAFE V5VG TL331IDBVR  ; pins 1 2 3 4 5
R48 V_SAFE V5VG 10k
X§U3 V_SAFE MAINP_ACTUAL N1N5 N1N5 MAINN_ACTUAL N1N7 0 N1N129 N1N7 PRE_ACTUAL N1N130 N1N129 N1N93 V5VG CD74HC08  ; pins 1 2 3 4 5 6 7 8 9 10 11 12 13 14
R46 V_DISCONNECT V5VG 10k
R57 V_DISCONNECT V5VG 10k
X§U13 V_DISCONNECT REL_FAULT_SET 0 N1N133 V5VG SN74LV1T32DBVR  ; pins 1 2 3 4 5
X§U16 N1N133 N1N131 0 N1N134 V5VG SN74LV1T08DBVR  ; pins 1 2 3 4 5
X§U15 NC_02 N1N198 0 N1N131 V5VG SN74LVC1G14DBVR  ; pins 1 2 3 4 5
X§U12 N1N134 N1N126 N1N126 0 N1N198 N1N93 N1N93 V5VG SN74LVC2G02DCTR  ; pins 1 2 3 4 5 6 7 8
X§U20 NC_03 N1N224 0 N1N198 V5VG SN74LVC1G17QDCKRQ1  ; pins 1 2 3 4 5
R64 N1N224 N1N223 1k
R55 0 N1N223 100k
C18 N1N223 V5VG 1µ
R1 N1N21 V5VR 2k
X§R3 N1N21 N1N23 N1N23 POT_TIED PARAMS: R=25k  ; pins 1 2 3
C2 N1N23 0 10µ
X§U4 0 N1N23 N1N19 N1N12 N1N15 N1N23 N1N21 V5VR NE555DR_HP  ; pins 1 2 3 4 5 6 7 8
C1 0 N1N15 10n
R5 N1N11 N1N19 2.2k
D§LED1 0 N1N11 DLED_RED
R34 N1N19 N1N18 1k
R63 0 N1N18 10k
X§Q1 N1N18 0 RED_OUT_K AO3480C_MACRO  ; pins G S D
X§F1 V12 N1N52 SMD2920P075TF_MACRO  ; pins 1 2
X§D6 0 N1N52 SMBJ18CA_MACRO  ; pins 1 2
C7 0 N1N52 220n
C10 0 N1N52 10µ
X§U10 N1N52 0 V5VR 0 LM340MP_5V  ; pins IN GND OUT TAB
C11 0 V5VR 10µ
C12 0 V5VR 100n
X§F2 V12 N1N65 SMD2920P075TF_MACRO  ; pins 1 2
X§D7 0 N1N65 SMBJ18CA_MACRO  ; pins 1 2
C13 0 N1N65 220n
C14 0 N1N65 10µ
X§U11 N1N65 0 V5VG 0 LM340MP_5V  ; pins IN GND OUT TAB
C15 0 V5VG 10µ
C16 0 V5VG 100n
R62 0 N1N130 10k
X§Q2 N1N130 0 GREEN_OUT_K AO3480C_MACRO  ; pins G S D
R29 N1N48 V5VR 1k
D§LED8 0 N1N48 DLED_RED
R30 N1N61 V5VG 1k
D§LED9 0 N1N61 DLED_RED
V_SUPPLY_12V V12 0 PWL(0 0 0.2m 12 160m 12 161m 0 175m 0 176m 12 260m 12)
V_CTRL V_CONTROLLER 0 PWL(0 0 20m 0 25m 1 60m 1 65m 0 260m 0)
V_BAT V_BATTERY 0 PWL(0 0 35m 0 40m 1 50m 1 55m 0 260m 0)
V_VDISC V_DISCONNECT 0 PWL(0 0 209m 0 210m 5 220m 5 221m 0 260m 0)
V_MP_ACT MAINP_ACTUAL 0 PWL(0 5 80m 5 81m 0 100m 0 101m 5 260m 5)
V_MN_ACT MAINN_ACTUAL 0 DC 5
V_PRE_ACT PRE_ACTUAL 0 DC 5
V_MP_SHD MAINP_SHOULD 0 DC 5
V_MN_SHD MAINN_SHOULD 0 DC 5
V_PRE_SHD PRE_SHOULD 0 DC 5
V_MP_DISC MAINP_DISCONNECT 0 PWL(0 0 119m 0 120m 5 130m 5 131m 0 260m 0)
V_MN_DISC MAINN_DISCONNECT 0 DC 0
V_PRE_DISC PRE_DISCONNECT 0 DC 0
RLOAD_RED V5VR RED_OUT_K 1k
RLOAD_GREEN V5VG GREEN_OUT_K 1k
.model D D
.lib standard.dio
*  TSAL relayout high-precision LTspice simulation - schematic-style block placement
*  Current TEL netlist used: Netlist_Schematic1_2026-05-02(1).tel. R64/U20 POR net is kept as fixed: R64.1/U20.2=N1N224, R64.2=C18.1/R55.2=N1N223.
*  Low-side outputs: RED_OUT_K and GREEN_OUT_K low = external lamp ON; high = lamp OFF.
.include TSAL_high_precision_models_v2.lib
.options plotwinsize=0 reltol=0.001 abstol=100p vntol=100u method=gear
.tran 0 260m 0 5u startup
.save V(V_CONTROLLER) V(V_BATTERY) V(V_SAFE) V(REL_FAULT_SET) V(N1N133) V(N1N134) V(N1N198) V(N1N93) V(N1N130) V(RED_OUT_K) V(GREEN_OUT_K) V(N1N19)
*  Signal sources and default values
*  Relay wire-break gating / OR merge
*  Red voltage judgement
*  Green voltage judgement + relay actual AND
*  Wire-break latch / POR reset
*  Red flashing lamp circuit
*  Red / green power modules
*  Timing testbench and expected behaviour
*  Defaults: DISCONNECT/SHOULD use pull-up style; ACTUAL uses pull-down style. VREF_0P6_R/G are 0.6 V comparator references.
*  REL_FAULT_SET = (MAINP_DISC&SHOULD) OR (MAINN_DISC&SHOULD) OR (PRE_DISC&SHOULD)
*  TL331 output is open collector. High on N1N12 releases NE555 RESET and enables red flash.
*  V_SAFE AND MAINP_ACTUAL AND MAINN_ACTUAL AND PRE_ACTUAL AND LATCH_OK -> green MOS gate.
*  POR fixed in current netlist: C18/R55 -> R64 -> U20.A; U20.Y=N1N198 reset pulse. N1N93=LATCH_OK.
*  555 flash output drives AO3480C low-side sink RED_OUT_K.
*  +5VR powers red comparator/555; +5VG powers green comparator/logic/latch.
*  Expected timing: 0-20ms safe/no fault -> green ON after POR. 25-60ms V_CONTROLLER>0.6 -> red flashes.
*  40-55ms V_BATTERY>0.6 -> green OFF. 81-100ms MAINP_ACTUAL=0 -> green OFF.
*  120-130ms MAINP_DISCONNECT=1 while SHOULD=1 -> latch trips; green remains OFF after input clears.
*  161-176ms LVS power cycle -> POR reset clears latch; 210-220ms V_DISCONNECT=1 -> latch trips again.
*  Plot: V(RED_OUT_K), V(GREEN_OUT_K), V(N1N12), V(V_SAFE), V(REL_FAULT_SET), V(N1N198), V(N1N93).
.backanno
.end